# Altium project FYDP_rev1.PrjPcb
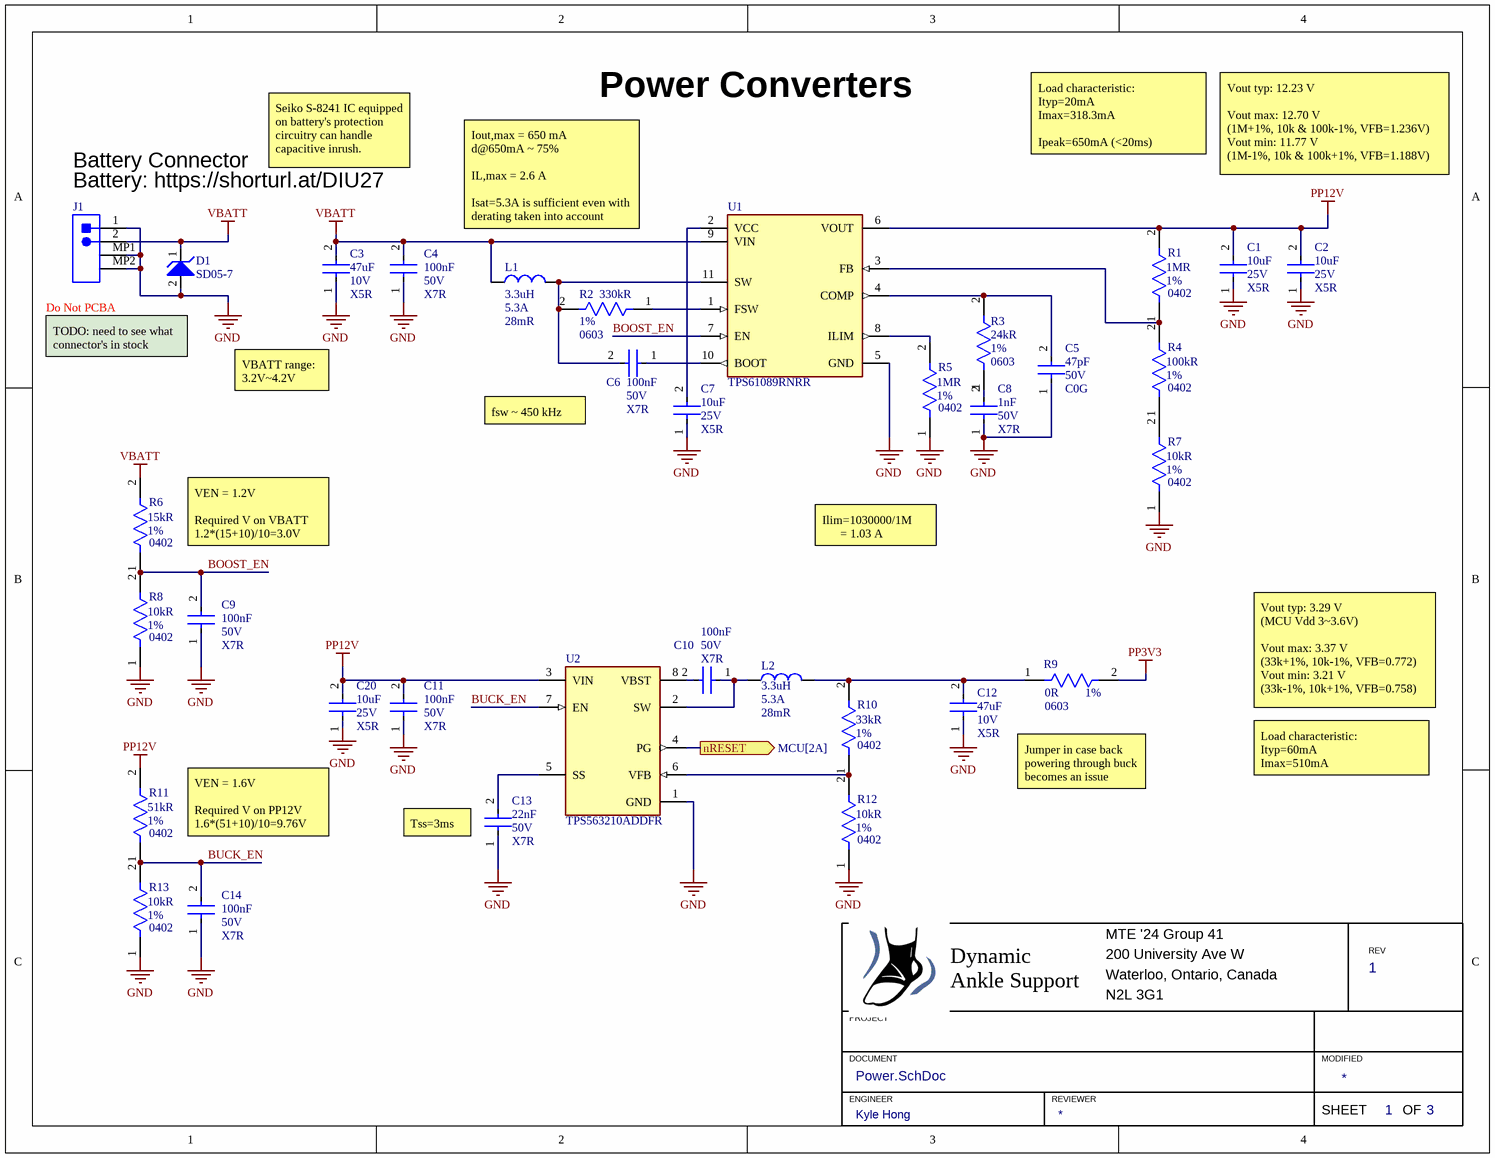
[diagram p0: Power.SchDoc]
3 sheets, 74 parts. Net scope: flat (ports and power ports of the same name join across sheets).
Board files: FYDP_rev1.PcbDoc, FYDP_rev1_revised_Cout.PcbDoc
Sheets:
  Power.SchDoc
  Driver.SchDoc
  MCU.SchDoc

## Sheet Power.SchDoc: Power Converters
size 279 x 215 mm; DrawnBy: Kyle Hong; Engineer: Kyle Hong; Revision: 1; SheetNumber: 1; SheetTotal: 3

### Parts
C1  Dielectric: X5R  Voltage Rating: 25V  Capacitance: 10uF  [CAP0805]  (hidden comment: CL21A106KAYNNNE)
C2  Dielectric: X5R  Voltage Rating: 25V  Capacitance: 10uF  [CAP0805]  (hidden comment: CL21A106KAYNNNE)
C3  Dielectric: X5R  Voltage Rating: 10V  Capacitance: 47uF  [CAP1206]  (hidden comment: CL31A476MPHNNNE)
C4  Dielectric: X7R  Voltage Rating: 50V  Capacitance: 100nF  [CAP0402]  (hidden comment: CL05B104KB54PNC)
C5  Dielectric: C0G  Voltage Rating: 50V  Capacitance: 47pF  [CAP0402]  (hidden comment: 0402CG470J500NT)
C6  Dielectric: X7R  Voltage Rating: 50V  Capacitance: 100nF  [CAP0402]  (hidden comment: CL05B104KB54PNC)
C7  Dielectric: X5R  Voltage Rating: 25V  Capacitance: 10uF  [CAP0805]  (hidden comment: CL21A106KAYNNNE)
C8  Dielectric: X7R  Voltage Rating: 50V  Capacitance: 1nF  [CAP0402]  (hidden comment: 0402B102K500NT)
C9  Dielectric: X7R  Voltage Rating: 50V  Capacitance: 100nF  [CAP0402]  (hidden comment: CL05B104KB54PNC)
C10  Dielectric: X7R  Voltage Rating: 50V  Capacitance: 100nF  [CAP0402]  (hidden comment: CL05B104KB54PNC)
C11  Dielectric: X7R  Voltage Rating: 50V  Capacitance: 100nF  [CAP0402]  (hidden comment: CL05B104KB54PNC)
C12  Dielectric: X5R  Voltage Rating: 10V  Capacitance: 47uF  [CAP1206]  (hidden comment: CL31A476MPHNNNE)
C13  Dielectric: X7R  Voltage Rating: 50V  Capacitance: 22nF  [CAP0402]  (hidden comment: 0402B223K500NT)
C14  Dielectric: X7R  Voltage Rating: 50V  Capacitance: 100nF  [CAP0402]  (hidden comment: CL05B104KB54PNC)
C20  Dielectric: X5R  Voltage Rating: 25V  Capacitance: 10uF  [CAP0805]  (hidden comment: CL21A106KAYNNNE)
D1  SD05-7  [SD05-7]
J1  S2B-PH-SM4-TB(LF)(SN)  [JST- S2B-PH-SM4-TB(LF)(SN)-2_V]  (value not drawn)
L1  DC Resistance: 28mR  Isat(min): 5.3A  Inductance: 3.3uH  [TMPA0503S-3R3MN-D]  (hidden comment: TMPA0503S-3R3MN-D)
L2  DC Resistance: 28mR  Isat(min): 5.3A  Inductance: 3.3uH  [TMPA0503S-3R3MN-D]  (hidden comment: TMPA0503S-3R3MN-D)
R1  Tolerance: 1%  Resistance: 1MR  Package: 0402  [RES0402]  (hidden comment: 0402WGF1004TCE)
R2  Tolerance: 1%  Resistance: 330kR  Package: 0603  [RES0603]  (hidden comment: 0603WAF3303T5E)
R3  Tolerance: 1%  Resistance: 24kR  Package: 0603  [RES0603]  (hidden comment: 0603WAF2402T5E)
R4  Tolerance: 1%  Resistance: 100kR  Package: 0402  [RES0402]  (hidden comment: 0402WGF1003TCE)
R5  Tolerance: 1%  Resistance: 1MR  Package: 0402  [RES0402]  (hidden comment: 0402WGF1004TCE)
R6  Tolerance: 1%  Resistance: 15kR  Package: 0402  [RES0402]  (hidden comment: 0402WGF1502TCE)
R7  Tolerance: 1%  Resistance: 10kR  Package: 0402  [RES0402]  (hidden comment: 0402WGF1002TCE)
R8  Tolerance: 1%  Resistance: 10kR  Package: 0402  [RES0402]  (hidden comment: 0402WGF1002TCE)
R9  Tolerance: 1%  Resistance: 0R  Package: 0603  [RES0603]  (hidden comment: 0603WAF0000T5E)
R10  Tolerance: 1%  Resistance: 33kR  Package: 0402  [RES0402]  (hidden comment: 0402WGF3302TCE)
R11  Tolerance: 1%  Resistance: 51kR  Package: 0402  [RES0402]  (hidden comment: 0402WGF5102TCE)
R12  Tolerance: 1%  Resistance: 10kR  Package: 0402  [RES0402]  (hidden comment: 0402WGF1002TCE)
R13  Tolerance: 1%  Resistance: 10kR  Package: 0402  [RES0402]  (hidden comment: 0402WGF1002TCE)
U1  TPS61089RNRR  [FP-RNR0011A-MFG]
U2  TPS563210ADDFR  [TPS563210ADDFR]

### Ports
nRESET (out, see MCU[2A])

### Nets
GND: C1.1 C2.1 C3.1 C4.1 C5.1 C7.1 C8.1 C9.1 C11.1 C12.1 C13.1 C14.1 C20.1 D1.2 J1.1 J1.MP1 J1.MP2 R5.1 R7.1 R8.1 R12.1 R13.1 U1.5(GND) U2.1(GND)
PP3V3: R9.2
PP12V: C1.2 C2.2 C11.2 C20.2 R1.2 R11.2 U1.6(VOUT) U2.3(VIN)
VBATT: C3.2 C4.2 D1.1 J1.2 L1.1 R6.2 U1.9(VIN)
BOOST_EN: C9.2 R6.1 R8.2 U1.7(EN)
BUCK_EN: C14.2 R11.1 R13.2 U2.7(EN)
NetC5_2: C5.2 R3.2 U1.4(COMP)
NetC6_1: C6.1 U1.10(BOOT)
NetC6_2: C6.2 L1.2 R2.2 U1.11(SW)
NetC7_2: C7.2 U1.2(VCC)
NetC8_2: C8.2 R3.1
NetC10_1: C10.1 L2.1 U2.2(SW)
NetC10_2: C10.2 U2.8(VBST)
NetC12_2: C12.2 L2.2 R9.1 R10.2
NetC13_2: C13.2 U2.5(SS)
NetR1_1: R1.1 R4.2 U1.3(FB)
NetR2_1: R2.1 U1.1(FSW)
NetR4_1: R4.1 R7.2
NetR5_2: R5.2 U1.8(ILIM)
NetR10_1: R10.1 R12.2 U2.6(VFB)
NetU2_4: U2.4(PG) ; port nRESET

### Notes on the sheet
- Power Converters
- Seiko S-8241 IC equipped on battery's protection circuitry can handle capacitive inrush.
- Load characteristic:
  Ityp=20mA
  Imax=318.3mA
  Ipeak=650mA (<20ms)
- Battery Connector
- (near J1) Battery: https://shorturl.at/DIU27
- Iout,max = 650 mA
  d@650mA ~ 75%
  IL,max = 2.6 A
  Isat=5.3A is sufficient even with derating taken into account
- Vout typ: 12.23 V
  Vout max: 12.70 V
  (1M+1%, 10k & 100k-1%, VFB=1.236V)
  Vout min: 11.77 V
  (1M-1%, 10k & 100k+1%, VFB=1.188V)
- (near J1) Do Not PCBA
- TODO: need to see what connector's in stock
- VBATT range: 3.2V~4.2V
- (near C6) fsw ~ 450 kHz
- VEN = 1.2V
  Required V on VBATT
  1.2*(15+10)/10=3.0V
- Ilim=1030000/1M
  = 1.03 A
- Vout typ: 3.29 V
  (MCU Vdd 3~3.6V)
  Vout max: 3.37 V
  (33k+1%, 10k-1%, VFB=0.772)
  Vout min: 3.21 V
  (33k-1%, 10k+1%, VFB=0.758)
- Load characteristic:
  Ityp=60mA
  Imax=510mA
- VEN = 1.6V
  Required V on PP12V
  1.6*(51+10)/10=9.76V
- (near C13) Tss=3ms
- Jumper in case back powering through buck becomes an issue
- 200 University Ave W
- MTE '24 Group 41
- REV
- PROJECT
- Dynamic Ankle Support
- Waterloo, Ontario, Canada
- N2L 3G1
- DOCUMENT
- ENGINEER
- REVIEWER
- MODIFIED
- SHEET
- OF

### Library data of the parts
C1 C2 C7 C20 = CAP0805: 25V 10uF X5R ±10% 0805  Multilayer Ceramic Capacitors MLCC - SMD/SMT ROHS; Manufacturer: Samsung Electro-Mechanics; Tolerance: 10%; Manufacturer Part Number: CL21A106KAYNNNE; Package: 0805
C3 C12 = CAP1206: 10V 47uF X5R ±20% 1206  Multilayer Ceramic Capacitors MLCC - SMD/SMT ROHS; Manufacturer: Samsung Electro-Mechanics; Tolerance: 20%; Manufacturer Part Number: CL31A476MPHNNNE; Package: 1206
C4 C6 C9-C11 C14 = CAP0402: 50V 100nF X7R ±10% 0402  Multilayer Ceramic Capacitors MLCC - SMD/SMT ROHS; Manufacturer: Samsung Electro-Mechanics; Tolerance: ±20%; Manufacturer Part Number: CL05B104KB54PNC; Package: 0402
C5 = CAP0402: 50V 47pF C0G ±5% 0402  Multilayer Ceramic Capacitors MLCC - SMD/SMT ROHS; Manufacturer: FH (Guangdong Fenghua Advanced Tech); Tolerance: ±5%; Manufacturer Part Number: 0402CG470J500NT; Package: 0402
C8 = CAP0402: 50V 1nF X7R ±10% 0402  Multilayer Ceramic Capacitors MLCC - SMD/SMT ROHS; Manufacturer: FH (Guangdong Fenghua Advanced Tech); Tolerance: ±10%; Manufacturer Part Number: 0402B102K500NT; Package: 0402
C13 = CAP0402: 50V 22nF X7R ±10% 0402  Multilayer Ceramic Capacitors MLCC - SMD/SMT ROHS; Manufacturer: FH (Guangdong Fenghua Advanced Tech); Tolerance: 10%; Manufacturer Part Number: 0402B223K500NT; Package: 0402
D1 = SD05-7: TVS UNI14.5V 6.2V 5V SOD-323; Manufacturer: Diodes Incorporated; Clamping Voltage: 14.5V; Breakdown Voltage: 6.2V; Reverse Standoff Voltage: 5V; Package: SOD-323; Manufacturer Part Number: SD05-7
J1 = CMP-1755-00001-1: Male Header, Pitch 2 mm, 1 x 2 Position, Height 5.5 mm, -25 to 85 degC, RoHS, Tape and Reel; Current Rating: 3 A; ComponentLink1URL: http://www.jst.com/home2.html; Radiation Hardening: No; RoHSCompliant: True; Mount: Through Hole; Contact Material: Bronze; Package Quantity: 100; Width: 2.34 mm; DatasheetVersion: Dec-12; Height: 8.13 mm; Max Operating Temperature: 105degC; ComponentLink2Description: Datasheet; Lead Pitch: 0.1 inch; Contact Finish: Lead; Packaging: Bulk; Colour: Black; Contact Plating: Tin; Min Operating Temperature: -65degC; ComponentLink1Description: Manufacturer URL; PackageReference: S2B-PH-SM4-TB(LF)(SN)-2; PackageDescription: Male Header, Pitch 2 mm, 1 x 2 Position, Height 5.5 mm; ComponentLink2URL: http://www.jst-mfg.com/product/pdf/eng/ePH.pdf; Pins: 40; Length: 101.19 mm
L1 L2 = TMPA0503S-3R3MN-D: INDUCTOR 5.3A 3.3uH ±20% SMD Power Inductors ROHS; Manufacturer: TAI-TECH; Manufacturer Part Number: TMPA0503S-3R3MN-D; Tolerance: 20%
R1 R5 = RES0402: 62.5mW Thick Film Resistors ±100ppm/℃ ±1% 1MΩ 0402  Chip Resistor - Surface Mount ROHS; Manufacturer: UNI-ROYAL(Uniroyal Elec); Power Rating: 62.5mW; Manufacturer Part Number: 0402WGF1004TCE
R2 = RES0603: 100mW Thick Film Resistors ±100ppm/℃ ±1% 330kΩ 0603  Chip Resistor - Surface Mount ROHS; Manufacturer: UNI-ROYAL(Uniroyal Elec); Power Rating: 100mW; Manufacturer Part Number: 0603WAF3303T5E
R3 = RES0603: 100mW Thick Film Resistors ±100ppm/℃ ±1% 24kΩ 0603  Chip Resistor - Surface Mount ROHS; Manufacturer: UNI-ROYAL(Uniroyal Elec); Power Rating: 100mW; Manufacturer Part Number: 0603WAF2402T5E
R4 = RES0402: 62.5mW Thick Film Resistors ±100ppm/℃ ±1% 100kΩ 0402  Chip Resistor - Surface Mount ROHS; Manufacturer: UNI-ROYAL(Uniroyal Elec); Power Rating: 62.5mW; Manufacturer Part Number: 0402WGF1003TCE
R6 = RES0402: 62.5mW Thick Film Resistors ±100ppm/℃ ±1% 15kΩ 0402  Chip Resistor - Surface Mount ROHS; Manufacturer: UNI-ROYAL(Uniroyal Elec); Power Rating: 62.5mW; Manufacturer Part Number: 0402WGF1502TCE
R7 R8 R12 R13 = RES0402: 62.5mW Thick Film Resistors ±100ppm/℃ ±1% 10kΩ 0402  Chip Resistor - Surface Mount ROHS; Manufacturer: UNI-ROYAL(Uniroyal Elec); Power Rating: 62.5mW; Manufacturer Part Number: 0402WGF1002TCE
R9 = RES0603: 100mW Thick Film Resistors ±1% 0Ω 0603  Chip Resistor - Surface Mount ROHS; Manufacturer: UNI-ROYAL(Uniroyal Elec); Power Rating: 100mW; Manufacturer Part Number: 0603WAF0000T5E
R10 = RES0402: 62.5mW Thick Film Resistors ±100ppm/℃ ±1% 33kΩ 0402  Chip Resistor - Surface Mount ROHS; Manufacturer: UNI-ROYAL(Uniroyal Elec); Power Rating: 62.5mW; Manufacturer Part Number: 0402WGF3302TCE
R11 = RES0402: 62.5mW Thick Film Resistors ±100ppm/℃ ±1% 51kΩ 0402  Chip Resistor - Surface Mount ROHS; Manufacturer: UNI-ROYAL(Uniroyal Elec); Power Rating: 62.5mW; Manufacturer Part Number: 0402WGF5102TCE
U1 = CMP-04918-000107-1: IC REG BOOST ADJ 7A 11VQFN; Manufacturer: Texas Instruments; Nominal Supply Current: 10uA; Output Type: AdjustableProgrammable; Max Junction Temp: +125°C; Switching Frequency: 200-2200kHz; Min Supply Voltage: 2.7V; Output Current: 8.1-10A; Number Of Outputs: 1; Standoff Height: 0mm; Max Supply Voltage: 12V; Output Voltage: 4.5-12.6V; Max Duty Cycle: 90%; Automotive: No; Height: 1mm; Manufacturer Part Number: TPS61089RNRR; Temperature Range Low: -40°C; Temperature Range High: +85°C; Temperature: -40°C to +85°C; Package: 11VQFN; Digikey Description: IC REG BOOST ADJ 7A 11VQFN; Device Class L2: Power Management ICs; Category: IC; ComponentLink2Description: Datasheet; Device Class L3: Voltage Regulators - Switching; Lead Free: Yes; Octopart: https://octopart.com/tps61089rnrr-texas+instruments-68059594; RoHS: TRUE; ComponentLink2URL: http://www.ti.com/lit/ds/symlink/tps61089.pdf; Switching Topology: Boost; Device Class L1: Integrated Circuits (ICs)
U2 = TPS563210ADDFR: IC REG BUCK ADJ 3A SOT-23-8; Manufacturer: Texas Instruments; Supplier 1: Mouser; Supplier Part Number 1: 595-TPS563210ADDFR; Manufacturer Part Number: TPS563210ADDFR; Package: SOT-23-8

## Sheet Driver.SchDoc
size 279 x 215 mm; Engineer: Kyle Hong; Revision: 1; SheetNumber: 2; SheetTotal: 3
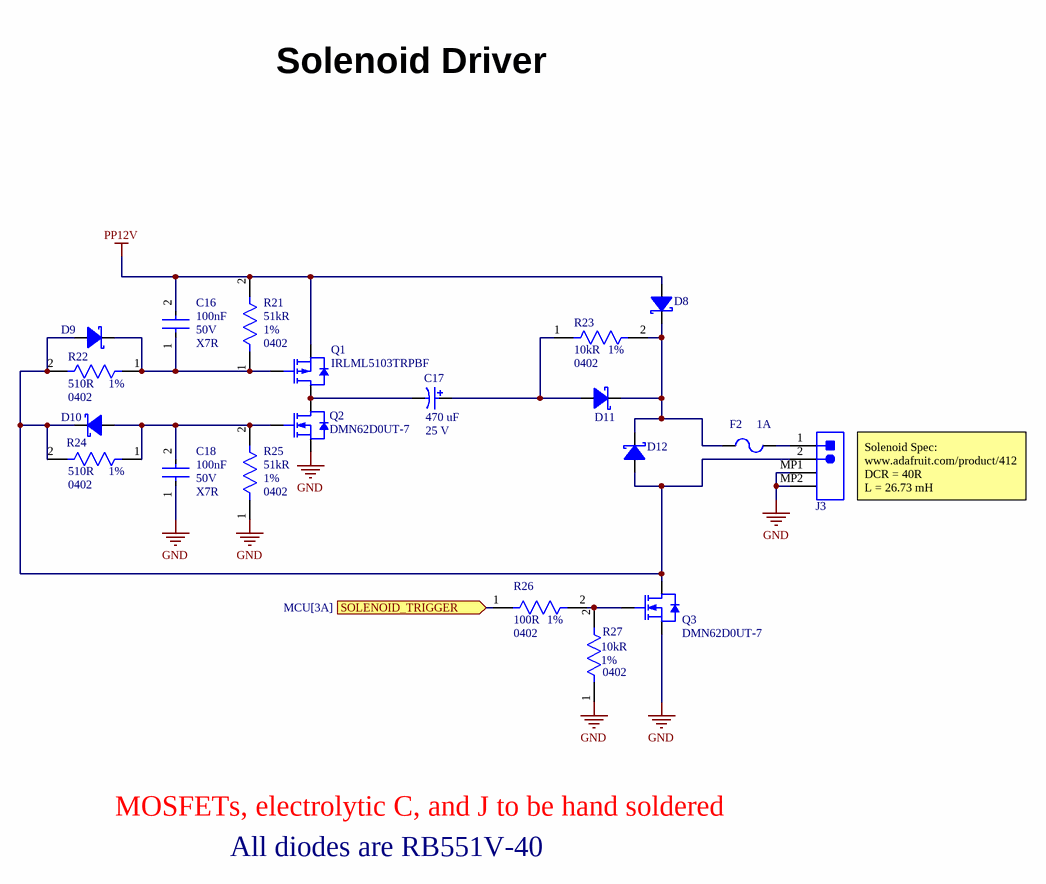
[diagram p1: Driver.SchDoc]

### Parts
C16  Dielectric: X7R  Voltage Rating: 50V  Capacitance: 100nF  [CAP0402]  (hidden comment: CL05B104KB54PNC)
C17  Rated Capacitance: 470 uF  Rated Voltage: 25 V  [NIC-CAPA2-10X10_V]  (hidden comment: UUD1E471MNL1GS)
C18  Dielectric: X7R  Voltage Rating: 50V  Capacitance: 100nF  [CAP0402]  (hidden comment: CL05B104KB54PNC)
D8  RB551V-40  [SOD-323]  (value not drawn)
D9  RB551V-40  [SOD-323]  (value not drawn)
D10  RB551V-40  [SOD-323]  (value not drawn)
D11  RB551V-40  [SOD-323]  (value not drawn)
D12  RB551V-40  [SOD-323]  (value not drawn)
F2  Current Rating: 1A  [FUSE_0603]  (hidden comment: 0467001.NRHF)
J3  S2B-PH-SM4-TB(LF)(SN)  [JST- S2B-PH-SM4-TB(LF)(SN)-2_V]  (value not drawn)
Q1  IRLML5103TRPBF  [SOT23-3]
Q2  DMN62D0UT-7  [SOT-523]
Q3  DMN62D0UT-7  [SOT-523]
R21  Tolerance: 1%  Resistance: 51kR  Package: 0402  [RES0402]  (hidden comment: 0402WGF5102TCE)
R22  Tolerance: 1%  Resistance: 510R  Package: 0402  [RES0402]  (hidden comment: 0402WGF5100TCE)
R23  Tolerance: 1%  Resistance: 10kR  Package: 0402  [RES0402]  (hidden comment: 0402WGF1002TCE)
R24  Tolerance: 1%  Resistance: 510R  Package: 0402  [RES0402]  (hidden comment: 0402WGF5100TCE)
R25  Tolerance: 1%  Resistance: 51kR  Package: 0402  [RES0402]  (hidden comment: 0402WGF5102TCE)
R26  Tolerance: 1%  Resistance: 100R  Package: 0402  [RES0402]  (hidden comment: 0402WGF1000TCE)
R27  Tolerance: 1%  Resistance: 10kR  Package: 0402  [RES0402]  (hidden comment: 0402WGF1002TCE)

### Ports
SOLENOID_TRIGGER (in, see MCU[3A])

### Nets
GND: C18.1 J3.MP1 J3.MP2 Q2.2(SOURCE) Q3.2(SOURCE) R25.1 R27.1
PP12V: C16.2 D8.2(Anode) Q1.2(Source) R21.2
SOLENOID_TRIG: R26.1 ; port SOLENOID_TRIGGER
NetC16_1: C16.1 D9.1(Cathode) Q1.1(Gate) R21.1 R22.1
NetC17_1: C17.1 D11.2(Anode) R23.1
NetC17_2: C17.2 Q1.3(Drain) Q2.3(DRAIN)
NetC18_2: C18.2 D10.2(Anode) Q2.1(GATE) R24.1 R25.2
NetD8_1: D8.1(Cathode) D11.1(Cathode) D12.1(Cathode) F2.1 R23.2
NetD9_2: D9.2(Anode) D10.1(Cathode) D12.2(Anode) J3.2 Q3.3(DRAIN) R22.2 R24.2
NetF2_2: F2.2 J3.1
NetQ3_1: Q3.1(GATE) R26.2 R27.2

### Notes on the sheet
- Solenoid Driver
- (near J3) Solenoid Spec:
  www.adafruit.com/product/412
  DCR = 40R
  L = 26.73 mH
- MOSFETs, electrolytic C, and J to be hand soldered
- All diodes are RB551V-40
- 200 University Ave W
- MTE '24 Group 41
- REV
- PROJECT
- Dynamic Ankle Support
- Waterloo, Ontario, Canada
- N2L 3G1
- DOCUMENT
- ENGINEER
- REVIEWER
- MODIFIED
- SHEET
- OF

### Library data of the parts
C16 C18 = CAP0402: as C4 on sheet Power; Manufacturer Part Number: CL05B104KB54PNC; Package: 0402
C17 = CMP-0687-00002-1: Aluminum Electrolytic Capacitor, UD Series, Low Impedance, 470 uF, 25 V, + / - 20%, -55 to 105 degC, Chip Type, 10 x 10 mm D x L, Pb-Free, Reel; Manufacturer: Nichicon; Impedance: 0.09 Ohm; Endurance Time: 5000 h; Rated Ripple Current (at 100kHz): 670 mA; Packing: Dia382mm Reel; Tolerance Rated Capacitance: -20 to 20%; ComponentLink3URL: http://products.nichicon.co.jp/en/pdf/XJA043/e-ud.pdf; ComponentLink2URL: http://products.nichicon.co.jp/en/pdf/XJA043/e-ud.pdf; Length: 10 mm; PartNumber: UUD1E471MNL1GS; ComponentLink3Description: Package Specification; PackageReference: CAPAE-D10H10; ComponentLink1URL: http://www.nichicon.co.jp/; DatasheetVersion: 08/2012; ComponentLink1Description: Manufacturer URL; ComponentLink2Description: Datasheet; Diameter: 10 mm; PackageDescription: 2-Pin Surface Mount Device, Diameter 10 mm, Height 10 mm, Pitch 8 mm; RoHS: TRUE; Mounting Technology: Surface Mount
D8-D12 = RB551V-40: 40V 470mV@500mA 0.5A SOD-323  Schottky Barrier Diodes (SBD) ROHS; Manufacturer: Taiwan Semiconductor; Vf (Max): 470mV @ 0.5A; Manufacturer Part Number: RB551V-40; Mounting Type: SMD; Vr (Max): 40V; Io: 0.5A; Package/Footprint: SOD-323
F2 = FUSE0603: 50A SMD Fuse 1A 32V 32V 0603  Fuses ROHS; Manufacturer: Littelfuse; Manufacturer Part Number: 0467001.NRHF; Package: 0603; Voltage Rating: 32V; Supplier 1: Future Electronics; Supplier Part Number 1: 6130137
J3 = CMP-1755-00001-1: as J1 on sheet Power; ComponentLink1URL: http://www.jst.com/home2.html; Radiation Hardening: No; RoHSCompliant: True; Mount: Through Hole; Contact Material: Bronze; Package Quantity: 100; Width: 2.34 mm; DatasheetVersion: Dec-12; Height: 8.13 mm; Max Operating Temperature: 105degC; ComponentLink2Description: Datasheet; Lead Pitch: 0.1 inch; Contact Finish: Lead; Packaging: Bulk; Colour: Black; Contact Plating: Tin; Min Operating Temperature: -65degC; ComponentLink1Description: Manufacturer URL; PackageReference: S2B-PH-SM4-TB(LF)(SN)-2; PackageDescription: Male Header, Pitch 2 mm, 1 x 2 Position, Height 5.5 mm; ComponentLink2URL: http://www.jst-mfg.com/product/pdf/eng/ePH.pdf; Pins: 40; Length: 101.19 mm
Q1 = IRLML5103TRPBF: P-Channel 30 V 760mA (Ta) 540mW (Ta) Surface Mount Micro3™/SOT-23; Manufacturer 1: Infineon Technologies; Vdss: 30V; Vgs (Max): ±20V; Power Dissipation (Max): 540mW (Ta); Mounting Type: SMD; Id: 760mA; Manufacturer Part Number 1: IRLML5103TRPBF; Supplier 1: Mouser; Supplier Part Number 1: 942-IRLML5103TRPBF
Q2 Q3 = DMN62D0UT-7: NFET 60 V 320mA (Ta) 230mW (Ta) Surface Mount SOT-523; Vdss: 60V; Vgs(th) (Max) @ Id: 1V @ 250uA; Vgs (Max): ±20V; Supplier 1: Digikey; Supplier Part Number 1: DMN62D0UT-7DICT-ND; Package: SOT-523; Id @ 25°C: 320mA
R21 R25 = RES0402: as R11 on sheet Power; Power Rating: 62.5mW; Manufacturer Part Number: 0402WGF5102TCE
R22 R24 = RES0402: 62.5mW Thick Film Resistors ±100ppm/℃ ±1% 510Ω 0402  Chip Resistor - Surface Mount ROHS; Manufacturer: UNI-ROYAL(Uniroyal Elec); Power Rating: 62.5mW; Manufacturer Part Number: 0402WGF5100TCE
R23 R27 = RES0402: as R7 on sheet Power; Power Rating: 62.5mW; Manufacturer Part Number: 0402WGF1002TCE
R26 = RES0402: 62.5mW Thick Film Resistors ±1% ±200ppm/℃ 100Ω 0402  Chip Resistor - Surface Mount ROHS; Manufacturer: UNI-ROYAL(Uniroyal Elec); Power Rating: 62.5mW; Manufacturer Part Number: 0402WGF1000TCE

## Sheet MCU.SchDoc
size 279 x 215 mm; Engineer: Kyle Hong; Revision: 1; SheetNumber: 3; SheetTotal: 3
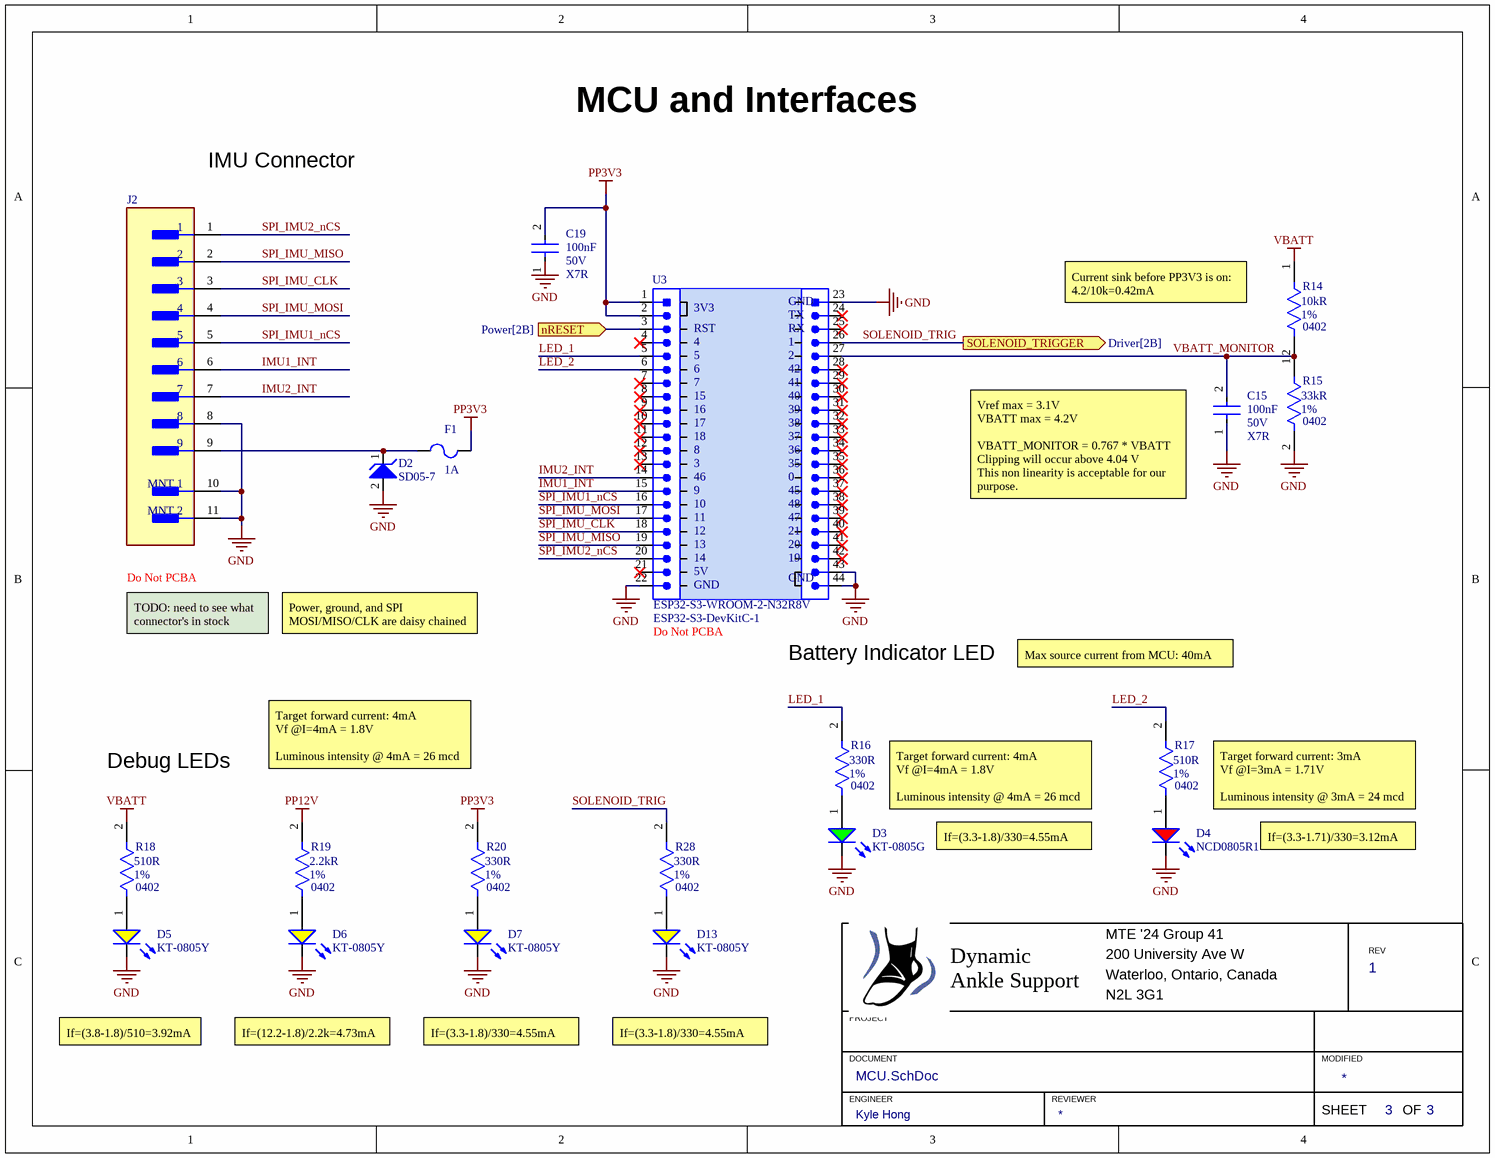
[diagram p2: MCU.SchDoc]

### Parts
C15  Dielectric: X7R  Voltage Rating: 50V  Capacitance: 100nF  [CAP0402]  (hidden comment: CL05B104KB54PNC)
C19  Dielectric: X7R  Voltage Rating: 50V  Capacitance: 100nF  [CAP0402]  (hidden comment: CL05B104KB54PNC)
D2  SD05-7  [SD05-7]
D3  KT-0805G  [LED_0805_GREEN]
D4  NCD0805R1  [LED_0805_RED]
D5  KT-0805Y  [LED_0805_YELLOW]
D6  KT-0805Y  [LED_0805_YELLOW]
D7  KT-0805Y  [LED_0805_YELLOW]
D13  KT-0805Y  [LED_0805_YELLOW]
F1  Current Rating: 1A  [FUSE_0603]  (hidden comment: 0467001.NRHF)
J2  S9B-PH-SM4-TB(LF)(SN)  [FP-S9B-PH-SM4-TB_LF_SN-MFG]  (value not drawn)
R14  Tolerance: 1%  Resistance: 10kR  Package: 0402  [RES0402]  (hidden comment: 0402WGF1002TCE)
R15  Tolerance: 1%  Resistance: 33kR  Package: 0402  [RES0402]  (hidden comment: 0402WGF3302TCE)
R16  Tolerance: 1%  Resistance: 330R  Package: 0402  [RES0402]  (hidden comment: 0402WGF3300TCE)
R17  Tolerance: 1%  Resistance: 510R  Package: 0402  [RES0402]  (hidden comment: 0402WGF5100TCE)
R18  Tolerance: 1%  Resistance: 510R  Package: 0402  [RES0402]  (hidden comment: 0402WGF5100TCE)
R19  Tolerance: 1%  Resistance: 2.2kR  Package: 0402  [RES0402]  (hidden comment: 0402WGF2201TCE)
R20  Tolerance: 1%  Resistance: 330R  Package: 0402  [RES0402]  (hidden comment: 0402WGF3300TCE)
R28  Tolerance: 1%  Resistance: 330R  Package: 0402  [RES0402]  (hidden comment: 0402WGF3300TCE)
U3  Dev Kit Part Number: ESP32-S3-DevKitC-1  [EPS32-S3-DevKitC]  (hidden comment: ESP32-S3-WROOM-2-N32R8V)

### Ports
nRESET (in, see Power[2B]), SOLENOID_TRIGGER (out, see Driver[2B])

### Nets
GND: C15.1 C19.1 D2.2 D3.1(K) D4.1(K) D5.1(K) D6.1(K) D7.1(K) D13.1(K) J2.8 J2.10(MNT_1) J2.11(MNT_2) R15.2 U3.22 U3.23 U3.43 U3.44
PP3V3: C19.2 F1.2 R20.2 U3.1 U3.2
PP12V: R19.2
VBATT: R14.1 R18.2
IMU1_INT: J2.6 U3.15
IMU2_INT: J2.7 U3.14
LED_1: R16.2 U3.5
LED_2: R17.2 U3.6
SOLENOID_TRIG: R28.2 U3.26 ; port SOLENOID_TRIGGER
SPI_IMU1_nCS: J2.5 U3.16
SPI_IMU2_nCS: J2.1 U3.20
SPI_IMU_CLK: J2.3 U3.18
SPI_IMU_MISO: J2.2 U3.19
SPI_IMU_MOSI: J2.4 U3.17
VBATT_MONITOR: C15.2 R14.2 R15.1 U3.27
NetD2_1: D2.1 F1.1 J2.9
NetD3_2: D3.2(A) R16.1
NetD4_2: D4.2(A) R17.1
NetD5_2: D5.2(A) R18.1
NetD6_2: D6.2(A) R19.1
NetD7_2: D7.2(A) R20.1
NetD13_2: D13.2(A) R28.1
NetU2_4: U3.3 ; port nRESET

Not connected (* = marked no-connect by the designer): U3 4* 7(6)* 8(6)* 9* 10* 11* 12* 13* 21* 24* 25* 28* 29* 30* 31* 32* 33* 34* 35* 36* 37* 38* 39* 40* 41* 42*

### Notes on the sheet
- MCU and Interfaces
- IMU Connector
- (near R14) Current sink before PP3V3 is on:
  4.2/10k=0.42mA
- (near C15) Vref max = 3.1V
  VBATT max = 4.2V
  VBATT_MONITOR = 0.767 * VBATT
  Clipping will occur above 4.04 V
  This non linearity is acceptable for our purpose.
- Do Not PCBA
- TODO: need to see what connector's in stock
- Power, ground, and SPI MOSI/MISO/CLK are daisy chained
- (near U3) Do Not PCBA
- Battery Indicator LED
- Max source current from MCU: 40mA
- Debug LEDs
- Target forward current: 4mA
  Vf @I=4mA = 1.8V
  Luminous intensity @ 4mA = 26 mcd
- Target forward current: 3mA
  Vf @I=3mA = 1.71V
  Luminous intensity @ 3mA = 24 mcd
- If=(3.3-1.8)/330=4.55mA
- If=(3.3-1.71)/330=3.12mA
- If=(3.8-1.8)/510=3.92mA
- If=(12.2-1.8)/2.2k=4.73mA
- 200 University Ave W
- MTE '24 Group 41
- REV
- PROJECT
- Dynamic Ankle Support
- Waterloo, Ontario, Canada
- N2L 3G1
- DOCUMENT
- ENGINEER
- REVIEWER
- MODIFIED
- SHEET
- OF
- (in symbol EPS32-S3-DevKitC) GND; 3V3; TX; RST; RX; 46; 0; 45; 48; 47; 5V

### Library data of the parts
C15 C19 = CAP0402: as C4 on sheet Power; Manufacturer Part Number: CL05B104KB54PNC; Package: 0402
D2 = SD05-7: as D1 on sheet Power; Breakdown Voltage: 6.2V; Reverse Standoff Voltage: 5V; Package: SOD-323; Manufacturer Part Number: SD05-7
D3 = LED_GREEN: Emerald 0805  Light Emitting Diodes (LED) ROHS; Manufacturer: Hubei KENTO Elec; Vf: 2.1V; If rated: 20mA; Manufacturer Part Number: KT-0805G
D4 = LED_RED: Colorless transparence 67mcd~195mcd -30℃~+85℃ 615nm~630nm Red 130° 65mW 0805  Light Emitting Diodes (LED) ROHS; Manufacturer: Foshan NationStar Optoelectronics; Vf: 2.0V; If rated: 25mA; Manufacturer Part Number: NCD0805R1
D5-D7 D13 = LED_YELLOW: Yellow 0805  Light Emitting Diodes (LED) ROHS; Manufacturer: Hubei KENTO Elec; Vf: 2.1V; If rated: 20mA; Manufacturer Part Number: KT-0805Y
F1 = FUSE0603: as F2 on sheet Driver; Manufacturer Part Number: 0467001.NRHF; Package: 0603; Voltage Rating: 32V; Supplier 1: Future Electronics; Supplier Part Number 1: 6130137
J2 = CMP-17439-000494-1: CONN HEADER SMD R/A 9POS 2MM; Voltage Rating (AC): 100V; Number of Poles: 9; Current Rating: 2A; Insulation Resistance: 1GR; Contact Resistance: 10mR; Gender: Male; Max Operating Temperature: 85°C; Number of Rows: 1; Color: White; Housing Color: Natural; Lead Free: Lead Free; Working Voltage: 100V; Contact Finish - Mating: TIN; Series: PH; Fastening Type: Detent; Packaging: Cut Tape; Housing Material: Nylon; Connector Type: Header; Mount: Surface Mount; Pitch: 2mm; Contact Shape: Square; Orientation: Right Angle; Voltage Rating: 100V; Lead Pitch: 2mm; Insulation Color: Natural; Min Operating Temperature: -25°C; Contact Plating: Tin; Contact Type: Male Pin; Reach SVHC Compliant: Yes; Number of Contacts: 9; Contact Material: Copper Alloy; Flammability Rating: UL94 V-0; Insulation Material: Nylon; Termination: Solder; Number of Positions: 9; Contact Mating Length: 0.13inch
R14 = RES0402: as R7 on sheet Power; Power Rating: 62.5mW; Manufacturer Part Number: 0402WGF1002TCE
R15 = RES0402: as R10 on sheet Power; Power Rating: 62.5mW; Manufacturer Part Number: 0402WGF3302TCE
R16 R20 R28 = RES0402: 62.5mW Thick Film Resistors ±100ppm/℃ ±1% 330Ω 0402  Chip Resistor - Surface Mount ROHS; Manufacturer: UNI-ROYAL(Uniroyal Elec); Power Rating: 62.5mW; Manufacturer Part Number: 0402WGF3300TCE
R17 R18 = RES0402: as R22 on sheet Driver; Power Rating: 62.5mW; Manufacturer Part Number: 0402WGF5100TCE
R19 = RES0402: 62.5mW Thick Film Resistors ±100ppm/℃ ±1% 2.2kΩ 0402  Chip Resistor - Surface Mount ROHS; Manufacturer: UNI-ROYAL(Uniroyal Elec); Power Rating: 62.5mW; Manufacturer Part Number: 0402WGF2201TCE
U3 = EPS32-S3-DevKitC: MCU Part Number: ESP32-S3-WROOM-2-N32R8V

## Nets that join several sheets
GND: Power (24 pins), Driver (7 pins), MCU (17 pins)
PP3V3: Power (R9.2), MCU (5 pins)
PP12V: Power (8 pins), Driver (C16.2 D8.2 Q1.2 R21.2), MCU (R19.2)
VBATT: Power (7 pins), MCU (R14.1 R18.2)
NetU2_4: Power (U2.4), MCU (U3.3)
SOLENOID_TRIG: Driver (R26.1), MCU (R28.2 U3.26)